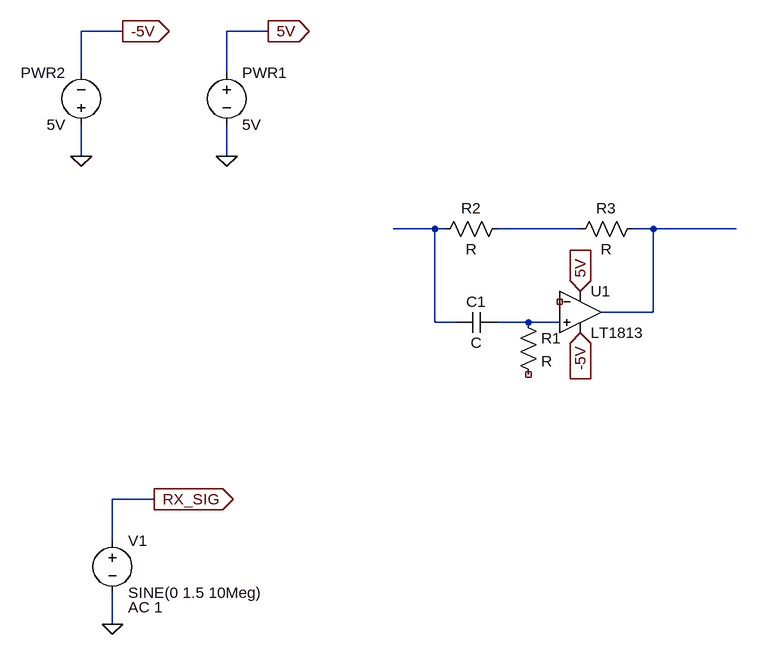
[diagram p0: schematic failedallpassfilter.asc]
failedallpassfilter.asc, the LTspice schematic file:
Version 4
SHEET 1 880 832
WIRE -176 -96 -240 -96
WIRE 48 -96 -16 -96
WIRE -240 -32 -240 -96
WIRE -16 -32 -16 -96
WIRE -240 96 -240 48
WIRE -16 96 -16 48
WIRE 304 208 240 208
WIRE 320 208 304 208
WIRE 528 208 400 208
WIRE 640 208 608 208
WIRE 768 208 640 208
WIRE 640 336 640 208
WIRE 640 336 560 336
WIRE 304 352 304 208
WIRE 336 352 304 352
WIRE 448 352 400 352
WIRE 496 352 448 352
WIRE -128 624 -192 624
WIRE -192 688 -192 624
WIRE -192 816 -192 768
FLAG -192 816 0
FLAG -128 624 RX_SIG
IOPIN -128 624 Out
FLAG -16 96 0
FLAG 48 -96 5V
IOPIN 48 -96 Out
FLAG -240 96 0
FLAG -176 -96 -5V
IOPIN -176 -96 Out
FLAG 528 304 5V
IOPIN 528 304 In
FLAG 528 368 -5V
IOPIN 528 368 In
SYMBOL OpAmps/LT1813 528 272 R0
SYMATTR InstName U1
SYMBOL Voltage -192 672 R0
WINDOW 123 24 118 Left 2
SYMATTR Value2 AC 1
SYMATTR InstName V1
SYMATTR Value SINE(0 1.5 10Meg)
SYMBOL Voltage -16 -48 R0
SYMATTR InstName PWR1
SYMATTR Value 5V
SYMBOL Voltage -240 64 R180
WINDOW 0 24 96 Left 2
WINDOW 3 24 16 Left 2
SYMATTR InstName PWR2
SYMATTR Value 5V
SYMBOL Res 432 336 R0
SYMATTR InstName R1
SYMBOL Res 416 192 R90
WINDOW 0 0 56 VBottom 2
WINDOW 3 32 56 VTop 2
SYMATTR InstName R2
SYMBOL Res 624 192 R90
WINDOW 0 0 56 VBottom 2
WINDOW 3 32 56 VTop 2
SYMATTR InstName R3
SYMBOL Cap 400 336 R90
WINDOW 0 0 32 VBottom 2
WINDOW 3 32 32 VTop 2
SYMATTR InstName C1

The netlist it stands for:
* failedallpassfilter.asc
XU1 N004 NC_01 5V -5V N003 LT1813  ; pins In+ In- V+ V- OUT
V1 RX_SIG 0 SINE(0 1.5 10Meg) AC 1
V§PWR1 5V 0 5V
V§PWR2 0 -5V 5V
R1 N004 NC_02 R
R2 N002 N001 R
R3 N003 N002 R
C1 N004 N001 C
.lib LTC.lib
.backanno
.end